# Altium project PuttPilot-Master.PrjPcb (part 1 of 4)
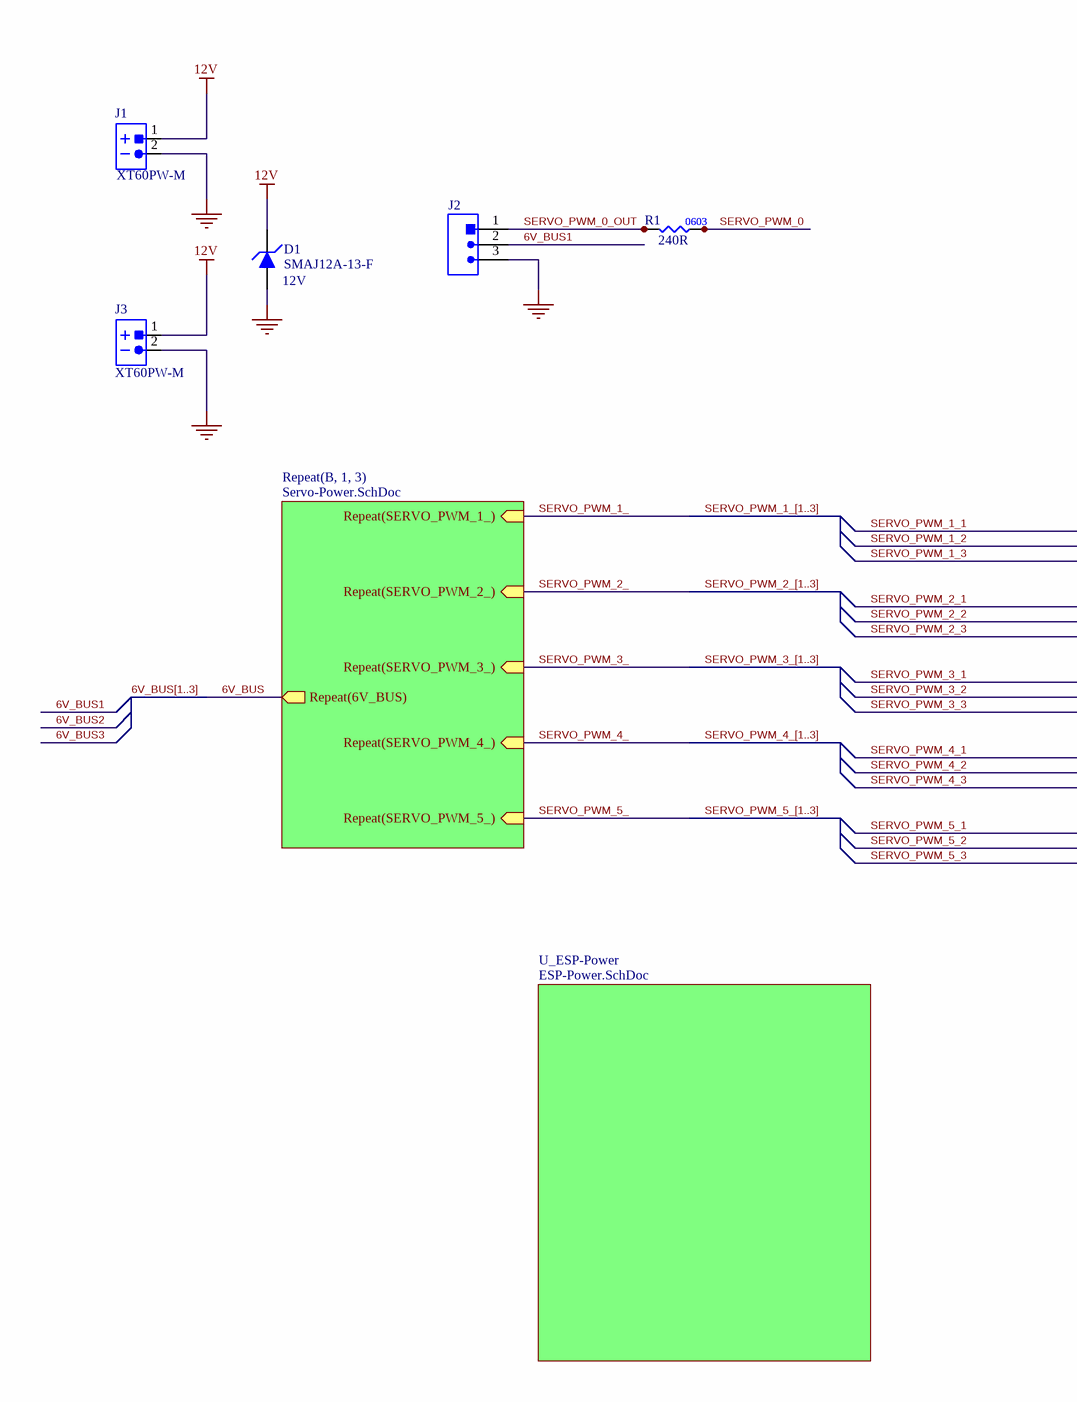
[diagram p0: Hierarchal.SchDoc, left]
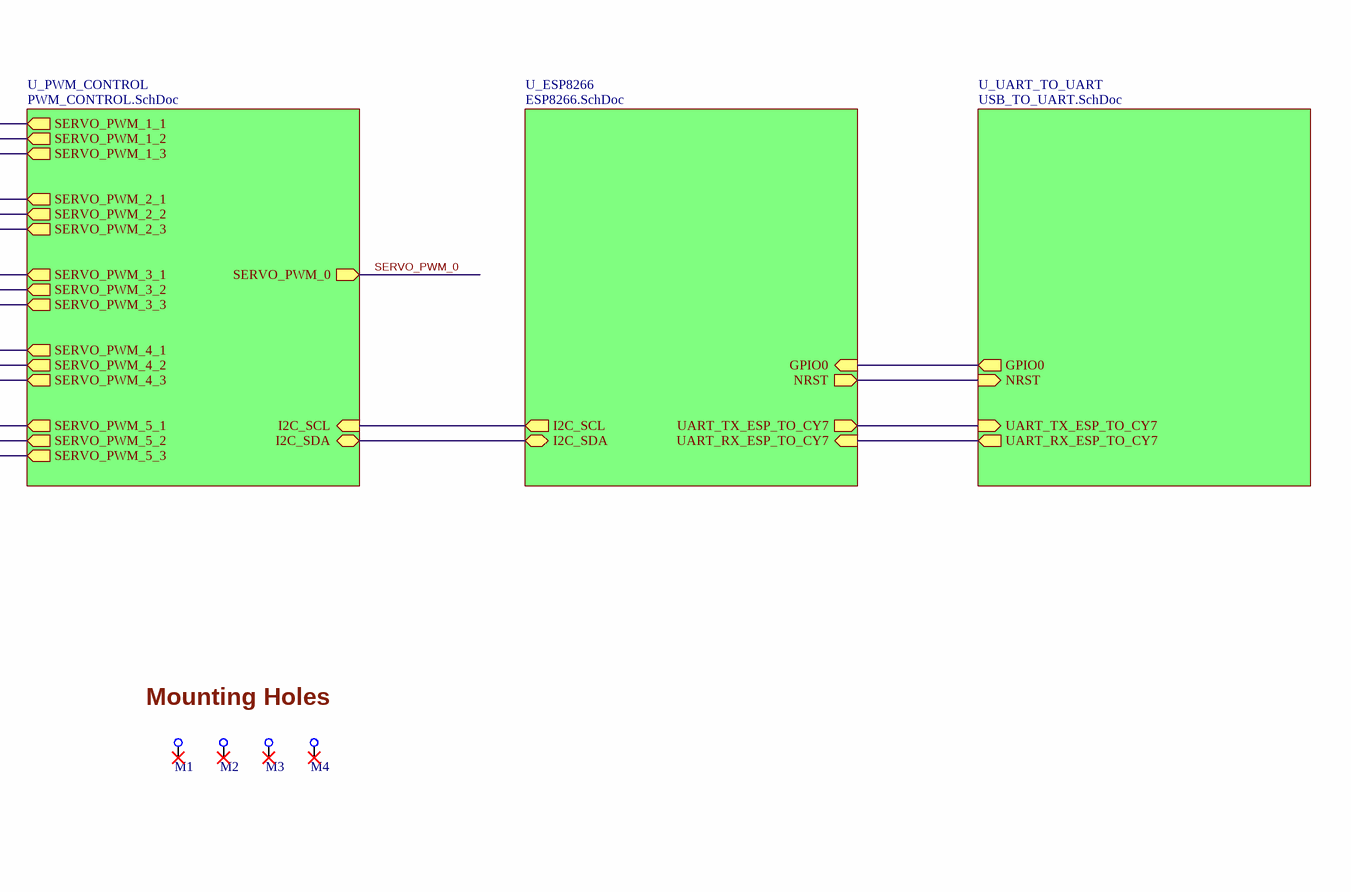
[diagram p1: Hierarchal.SchDoc, right]
6 sheets, 225 parts. Net scope: hierarchical (ports join the sheet entries above them; power ports are global).
Board file: PuttPilot-Master.PcbDoc
Sheets:
  Hierarchal.SchDoc
    U_PWM_CONTROL = PWM_CONTROL.SchDoc
    U_ESP8266 = ESP8266.SchDoc
    U_ESP-Power = ESP-Power.SchDoc
    U_UART_TO_UART = USB_TO_UART.SchDoc
    B1 = Servo-Power.SchDoc
    B2 = Servo-Power.SchDoc
    B3 = Servo-Power.SchDoc

## Sheet Hierarchal.SchDoc: Hierarchal Power
size 431 x 279 mm; DrawnBy: Ethan Abraham; Engineer: Ethan Abraham; SheetNumber: 2; SheetTotal: 7

### Parts
D1  SMAJ12A-13-F  Rep Pk Reverse Voltage-Max: 12V  [SMAJ12A-13-F]
J1  XT60PW-M  [XT60PW-M]
J2  PRPC040SAAN-RC  [HEADER_3POS_2.54MM]  (value not drawn)
J3  XT60PW-M  [XT60PW-M]
M1  .HOLE_M3  [.HOLE_M3]  (value not drawn)
M2  .HOLE_M3  [.HOLE_M3]  (value not drawn)
M3  .HOLE_M3  [.HOLE_M3]  (value not drawn)
M4  .HOLE_M3  [.HOLE_M3]  (value not drawn)
R1  Resistance: 240R  [.RES_0603]  (hidden comment: RC0603FR-07240RL)

### Sub-sheets
Repeat(B, 1, 3) = Servo-Power.SchDoc: Repeat(6V_BUS) (out), Repeat(SERVO_PWM_1_) (in), Repeat(SERVO_PWM_2_) (in), Repeat(SERVO_PWM_3_) (in), Repeat(SERVO_PWM_4_) (in), Repeat(SERVO_PWM_5_) (in)
U_ESP8266 = ESP8266.SchDoc: I2C_SDA (bidir), I2C_SCL (out), UART_TX_ESP_TO_CY7 (out), UART_RX_ESP_TO_CY7 (in), GPIO0 (in), NRST (out)
U_ESP-Power = ESP-Power.SchDoc: no entries
U_PWM_CONTROL = PWM_CONTROL.SchDoc: SERVO_PWM_0 (out), I2C_SCL (in), I2C_SDA (bidir), SERVO_PWM_1_1 (out), SERVO_PWM_2_1 (out), SERVO_PWM_3_1 (out), SERVO_PWM_4_1 (out), SERVO_PWM_5_1 (out), SERVO_PWM_1_2 (out), SERVO_PWM_2_2 (out), SERVO_PWM_3_2 (out), SERVO_PWM_4_2 (out), SERVO_PWM_5_2 (out), SERVO_PWM_1_3 (out), SERVO_PWM_2_3 (out), SERVO_PWM_3_3 (out), SERVO_PWM_4_3 (out), SERVO_PWM_5_3 (out)
U_UART_TO_UART = USB_TO_UART.SchDoc: UART_RX_ESP_TO_CY7 (out), UART_TX_ESP_TO_CY7 (in), NRST (in), GPIO0 (out)

### Nets
12V: D1.2(Pin_2) J1.1 J3.1
GND: D1.1(Pin_1) J1.2 J2.3 J3.2
6V_BUS: sheet Repeat(B, 1, 3)/Repeat(6V_BUS)
6V_BUS1: J2.2  [project net 6V_BUS]
GPIO0: sheet U_ESP8266/GPIO0, sheet U_UART_TO_UART/GPIO0
I2C_SCL: sheet U_PWM_CONTROL/I2C_SCL, sheet U_ESP8266/I2C_SCL
I2C_SDA: sheet U_PWM_CONTROL/I2C_SDA, sheet U_ESP8266/I2C_SDA
NRST: sheet U_ESP8266/NRST, sheet U_UART_TO_UART/NRST
SERVO_PWM_0: R1.2 ; sheet U_PWM_CONTROL/SERVO_PWM_0
SERVO_PWM_0_OUT: J2.1 R1.1
SERVO_PWM_1_: sheet Repeat(B, 1, 3)/Repeat(SERVO_PWM_1_)
SERVO_PWM_2_: sheet Repeat(B, 1, 3)/Repeat(SERVO_PWM_2_)
SERVO_PWM_3_: sheet Repeat(B, 1, 3)/Repeat(SERVO_PWM_3_)
SERVO_PWM_4_: sheet Repeat(B, 1, 3)/Repeat(SERVO_PWM_4_)
SERVO_PWM_5_: sheet Repeat(B, 1, 3)/Repeat(SERVO_PWM_5_)
UART_RX_ESP_TO_CY7: sheet U_ESP8266/UART_RX_ESP_TO_CY7, sheet U_UART_TO_UART/UART_RX_ESP_TO_CY7
UART_TX_ESP_TO_CY7: sheet U_ESP8266/UART_TX_ESP_TO_CY7, sheet U_UART_TO_UART/UART_TX_ESP_TO_CY7

Not connected (* = marked no-connect by the designer): M1 1*; M2 1*; M3 1*; M4 1*

### Buses and harness runs
bus 6V_BUS[1..3]
bus SERVO_PWM_1_[1..3]
bus SERVO_PWM_2_[1..3]
bus SERVO_PWM_3_[1..3]
bus SERVO_PWM_4_[1..3]
bus SERVO_PWM_5_[1..3]

### Notes on the sheet
- Mounting Holes
- PuttPilot
- 200 University Ave W
- Waterloo, Ontario, Canada
- PROJECT
- N2L 3G1
- REVISION
- DOCUMENT
- ENGINEER
- REVIEWER
- MODIFIED
- SHEET
- OF

### Library data of the parts
D1 = SMAJ12A-13-F: TVS DIODE 12VWM; Manufacturer: Diodes; Package Body Material: Plastic; Diode Element Material: SILICON; Diode Type: TRANS VOLTAGE SUPPRESSOR; Number of Elements: 1; Time @ Peak Reflow Temperature-Max (s): 40s; Polarity: Unidirectional; Additional Feature: EXCELLENT CLAMPING CAPABILITY; Max Breakdown Voltage: 14.7V; Min Breakdown Voltage: 13.3V; Breakdown Voltage-Nom: 14V; Clamping Voltage-Max: 19.9V; Non-rep Peak Rev Power Dis-Max: 400W; Max Power Dissipation: 1W; Qualification Status: Not Qualified; Supplier 1: Digikey; Manufacturer Part Number: SMAJ12A-13-F; RoHS: Yes; Category: TVS Diodes; Stock 1: 25706; Pricing 1: 1=0.29, 10=0.197, 100=0.1322, 500=0.1019, 1000=0.09178, 2000=0.08313 (USD); Number of Pins: 2; Package Shape: Rectangular; Terminal Finish: Tin; Min Operating Temperature: -55°C; Max Operating Temperature: 150°C; JESD-609 Code: e3; JESD-30 Code: R-PDSO-C2; Package Style: SMALL OUTLINEMeter; Surface Mount: Yes; Terminal Form: C BEND; Terminal Position: DUAL; Moisture Sensitivity Level: 1; Peak Reflow Temperature (Cel): 260°C; Technology: AVALANCHE; RoHS Compliant: Yes; Reach SVHC Compliant: No; ComponentLink1URL: https://datasheet.ciiva.com:443/pdfs/VipMasterIC/IC/DIOD/DIOD-S-A0009689838/DIOD-S-A0009691421-1.pdf?src-supplier=IHS+Markit; ComponentLink1Description: https://datasheet.ciiva.com:443/pdfs/VipMasterIC/IC/DIOD/DIOD-S-A0009689838/DIOD-S-A0009691421-1.pdf?src-supplier=IHS+Markit; ComponentLink2URL: https://datasheet.ciiva.com/15143/getdatasheetpartid-164236-15143864.pdf?src-supplier=Verical; ComponentLink2Description: https://datasheet.ciiva.com/15143/getdatasheetpartid-164236-15143864.pdf?src-supplier=Verical; Supplier Part Number 1: SMAJ12A-FDICT-ND
J1 J3 = XT60PW-M: XT60PW Male; Manufacturer: Unclassified; Manufacturer Part Number: XT60PW-M; Supplier Part Number 1: 1805375
J2 = PRPC040SAAN-RC: CONN HEADER VERT 3POS 2.54MM; Manufacturer: Sullins; Manufacturer Series: PRP; Connector Type: BOARD CONNECTOR; Contact Pattern: RECTANGULAR; Contact Style: SQ PIN-SKT; Number Of Connectors: 1; Rated Current (Signal): 3A; Number of Contacts: 40; Body Breadth: 0.1inch; Body Length: 4inch; Reference Standard: UL; Reliability: COMMERCIAL; Supplier 1: Digikey; Manufacturer Part Number: PRPC040SAAN-RC; RoHS: Yes; Category: Headers and Wire Housings; Stock 1: 73516; Pricing 1: 1=0.42, 10=0.316, 100=0.2417, 500=0.2017, 1000=0.18701, 5000=0.15795, 10000=0.14845 (USD); Mount: Board; Contact Material: Brass; Contact Finish - Mating: AU ON NI; Contact Finish - Termination: Gold (Au) - with Nickel (Ni) barrier; Insulation Material: Polybutylene; Min Operating Temperature: -40°C; Max Operating Temperature: 105°C; JESD-609 Code: e4; Contact Gender: Male; Mounting Style: STRAIGHT; Number Of PCB Rows: 1; Number of Rows Loaded: 1; PCB Contact Pattern: RECTANGULAR; Termination: Solder; Body Depth: 0.1inch; Mating Contact Pitch: 0.1inch; Terminal Length: 0.12inch; Terminal Pitch: 2.54mm; Reach SVHC Compliant: Yes; RoHS Compliant: Yes; ComponentLink1URL: https://datasheet.ciiva.com:443/pdfs/VipMasterIC/IC/SUCS/SUCSS00322/SUCSS00322-1.pdf?src-supplier=IHS+Markit; ComponentLink1Description: https://datasheet.ciiva.com:443/pdfs/VipMasterIC/IC/SUCS/SUCSS00322/SUCSS00322-1.pdf?src-supplier=IHS+Markit; ComponentLink2URL: https://datasheet.ciiva.com/16477/prpc040saan-rc-16477647.pdf?src-supplier=Future+Electronics; ComponentLink2Description: https://datasheet.ciiva.com/16477/prpc040saan-rc-16477647.pdf?src-supplier=Future+Electronics; ComponentLink3URL: https://datasheet.ciiva.com/741/xrxczzzsxxn-rc-st-11635-b-741205.pdf?src-supplier=Digikey; ComponentLink3Description: https://datasheet.ciiva.com/741/xrxczzzsxxn-rc-st-11635-b-741205.pdf?src-supplier=Digikey; Supplier Part Number 1: S1011EC-02-ND
M1-M4 = .HOLE_M3: .HOLE M3
R1 = RC0603FR-07240RL: RES 240 OHM 0603; Manufacturer: Yageo; Tolerance: 1%; Additional Feature: LASER TRIMMABLE; Rated Power Dissipation (P): 100mW; Rated Temperature: 70°C; Temperature Coefficient: 100ppm/°C; Working Voltage: 75V; Package Height: 0.45mm; Package Length: 1.6mm; Package Width: 0.8mm; Supplier 1: Future Electronics; Manufacturer Part Number: RC0603FR-07240RL; RoHS: Yes; Category: Chip SMD Resistors; Stock 1: 1760000; Pricing 1: 5000=0.0026, 50000=0.0025, 150000=0.0024, 375000=0.0023, 1000000=0.0022 (USD); Mount: Surface Mount; Number of Pins: 2; Package Shape: Rectangular; Size Code: 0603; Terminal Finish: Nickel; Min Operating Temperature: -55°C; Max Operating Temperature: 155°C; JESD-609 Code: e3; Resistor Type: FIXED RESISTOR; Construction: Chip; Package Style: SMTMeter; Packaging: Tape and Reel; Technology: METAL GLAZE/THICK FILM; Termination: Wraparound; Reach SVHC Compliant: Yes; RoHS Compliant: Yes; ComponentLink1URL: https://datasheet.ciiva.com:443/pdfs/VipMasterIC/IC/YAGO/YAGO-S-A0008145938/YAGO-S-A0008145938-1.pdf?src-supplier=IHS+Markit; ComponentLink1Description: https://datasheet.ciiva.com:443/pdfs/VipMasterIC/IC/YAGO/YAGO-S-A0008145938/YAGO-S-A0008145938-1.pdf?src-supplier=IHS+Markit; ComponentLink2URL: https://datasheet.ciiva.com/2508/pyu-r-int-thick-7-2508497.pdf?src-supplier=Digikey; ComponentLink2Description: https://datasheet.ciiva.com/2508/pyu-r-int-thick-7-2508497.pdf?src-supplier=Digikey; ComponentLink3URL: https://datasheet.ciiva.com/2508/pyu-r-int-thick-7-2508498.pdf?src-supplier=Digikey; ComponentLink3Description: https://datasheet.ciiva.com/2508/pyu-r-int-thick-7-2508498.pdf?src-supplier=Digikey; ComponentLink4URL: https://datasheet.ciiva.com/2508/pyu-r-int-thick-7-2508499.pdf?src-supplier=Digikey; ComponentLink4Description: https://datasheet.ciiva.com/2508/pyu-r-int-thick-7-2508499.pdf?src-supplier=Digikey; Supplier Part Number 1: 5308184

## Sheet PWM_CONTROL.SchDoc: PWM Control
size 279 x 215 mm; DrawnBy: Ethan Abraham; Engineer: Ethan Abraham; Revision: 1.0; SheetNumber: 7; SheetTotal: 7
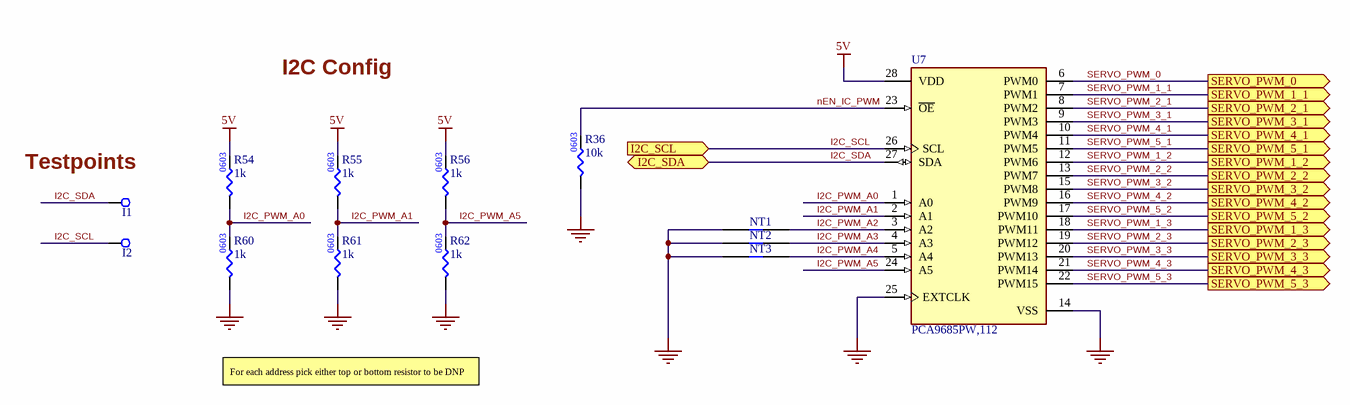
[diagram p2: PWM_CONTROL.SchDoc]

### Parts
I1  RCWCTE  [RCWCTE]  (value not drawn)
I2  RCWCTE  [RCWCTE]  (value not drawn)
NT1  .NET_TIE  [.NET_TIE]  (value not drawn)
NT2  .NET_TIE  [.NET_TIE]  (value not drawn)
NT3  .NET_TIE  [.NET_TIE]  (value not drawn)
R36  Resistance: 10k  [.RES_0603]  (hidden comment: RC0603FR-0710KL)
R54  Resistance: 1k  [.RES_0603]  (hidden comment: RC0603FR-071KL)
R55  Resistance: 1k  [.RES_0603]  (hidden comment: RC0603FR-071KL)
R56  Resistance: 1k  [.RES_0603]  (hidden comment: RC0603FR-071KL)
R60  Resistance: 1k  [.RES_0603]  (hidden comment: RC0603FR-071KL)
R61  Resistance: 1k  [.RES_0603]  (hidden comment: RC0603FR-071KL)
R62  Resistance: 1k  [.RES_0603]  (hidden comment: RC0603FR-071KL)
U7  PCA9685PW,112  [PCA9685PW,112]

### Ports
I2C_SCL (in), I2C_SDA (bidir), SERVO_PWM_0 (out), SERVO_PWM_1_1 (out), SERVO_PWM_1_2 (out), SERVO_PWM_1_3 (out), SERVO_PWM_2_1 (out), SERVO_PWM_2_2 (out), SERVO_PWM_2_3 (out), SERVO_PWM_3_1 (out), SERVO_PWM_3_2 (out), SERVO_PWM_3_3 (out), SERVO_PWM_4_1 (out), SERVO_PWM_4_2 (out), SERVO_PWM_4_3 (out), SERVO_PWM_5_1 (out), SERVO_PWM_5_2 (out), SERVO_PWM_5_3 (out)

### Nets
5V: R54.2 R55.2 R56.2 U7.28(VDD)
GND: NT1.1 NT2.1 NT3.1 R36.1 R60.1 R61.1 R62.1 U7.14(VSS) U7.25(EXTCLK)
I2C_PWM_A0: R54.1 R60.2 U7.1(A0)
I2C_PWM_A1: R55.1 R61.2 U7.2(A1)
I2C_PWM_A2: NT1.2 U7.3(A2)
I2C_PWM_A3: NT2.2 U7.4(A3)
I2C_PWM_A4: NT3.2 U7.5(A4)
I2C_PWM_A5: R56.1 R62.2 U7.24(A5)
I2C_SCL: I2.1 U7.26(SCL) ; port I2C_SCL
I2C_SDA: I1.1 U7.27(SDA) ; port I2C_SDA
nEN_IC_PWM: R36.2 U7.23(~{OE})
SERVO_PWM_0: U7.6(PWM0) ; port SERVO_PWM_0
SERVO_PWM_1_1: U7.7(PWM1) ; port SERVO_PWM_1_1  [project net SERVO_PWM_1_]
SERVO_PWM_1_2: U7.12(PWM6) ; port SERVO_PWM_1_2  [project net SERVO_PWM_1_]
SERVO_PWM_1_3: U7.18(PWM11) ; port SERVO_PWM_1_3  [project net SERVO_PWM_1_]
SERVO_PWM_2_1: U7.8(PWM2) ; port SERVO_PWM_2_1  [project net SERVO_PWM_2_]
SERVO_PWM_2_2: U7.13(PWM7) ; port SERVO_PWM_2_2  [project net SERVO_PWM_2_]
SERVO_PWM_2_3: U7.19(PWM12) ; port SERVO_PWM_2_3  [project net SERVO_PWM_2_]
SERVO_PWM_3_1: U7.9(PWM3) ; port SERVO_PWM_3_1  [project net SERVO_PWM_3_]
SERVO_PWM_3_2: U7.15(PWM8) ; port SERVO_PWM_3_2  [project net SERVO_PWM_3_]
SERVO_PWM_3_3: U7.20(PWM13) ; port SERVO_PWM_3_3  [project net SERVO_PWM_3_]
SERVO_PWM_4_1: U7.10(PWM4) ; port SERVO_PWM_4_1  [project net SERVO_PWM_4_]
SERVO_PWM_4_2: U7.16(PWM9) ; port SERVO_PWM_4_2  [project net SERVO_PWM_4_]
SERVO_PWM_4_3: U7.21(PWM14) ; port SERVO_PWM_4_3  [project net SERVO_PWM_4_]
SERVO_PWM_5_1: U7.11(PWM5) ; port SERVO_PWM_5_1  [project net SERVO_PWM_5_]
SERVO_PWM_5_2: U7.17(PWM10) ; port SERVO_PWM_5_2  [project net SERVO_PWM_5_]
SERVO_PWM_5_3: U7.22(PWM15) ; port SERVO_PWM_5_3  [project net SERVO_PWM_5_]

### Notes on the sheet
- I2C Config
- (near I1) Testpoints
- For each address pick either top or bottom resistor to be DNP
- PuttPilot
- 200 University Ave W
- PROJECT
- Waterloo, Ontario, Canada
- N2L 3G1
- REVISION
- DOCUMENT
- ENGINEER
- REVIEWER
- MODIFIED
- SHEET
- OF

### Library data of the parts
I1 I2 = RCWCTE: SMT Test Point; Manufacturer: KOA Speer; Resistance: 0R; Current Rating: 2A; Number of Contacts: 1; Supplier 1: Digikey; Manufacturer Part Number: RCWCTE; RoHS: Yes; Category: Chip SMD Resistors; Stock 1: 56953; Pricing 1: 1=0.2, 10=0.15, 25=0.1344, 50=0.1238, 100=0.1141, 250=0.10268, 500=0.09488, 1000=0.08781 (USD); Mount: Surface Mount; Case/Package: 1206; Case Code (Imperial): 1206; Case Code (Metric): 3216; Contact Material: Copper,Tin; Min Operating Temperature: -55°C; Max Operating Temperature: 125°C; Packaging: Tape and Reel; Termination: SMD/SMT; Series: RC; Length: 3.2mm; Width: 1.6mm; Height: 2mm; Depth: 1.6mm; Military Standard: Not; RoHS Compliant: Yes; ComponentLink1URL: https://datasheet.ciiva.com/34302/1876186-34302940.pdf?src-supplier=Jameco; ComponentLink1Description: https://datasheet.ciiva.com/34302/1876186-34302940.pdf?src-supplier=Jameco; ComponentLink2URL: https://datasheet.ciiva.com/5556/rc-5556236.pdf?src-supplier=Mouser; ComponentLink2Description: https://datasheet.ciiva.com/5556/rc-5556236.pdf?src-supplier=Mouser; ComponentLink3URL: https://datasheet.ciiva.com/26821/getdatasheetpartid-110197-26821157.pdf?src-supplier=Verical; ComponentLink3Description: https://datasheet.ciiva.com/26821/getdatasheetpartid-110197-26821157.pdf?src-supplier=Verical; Supplier Part Number 1: 2019-RCWCTECT-ND
NT1-NT3 = .NET_TIE: .GENERIC NET TIE
R36 = RC0603FR-0710KL: RES 10K OHM 0603; Manufacturer: Yageo; Tolerance: 1%; Additional Feature: LASER TRIMMABLE; Rated Power Dissipation (P): 100mW; Rated Temperature: 70°C; Temperature Coefficient: 100ppm/°C; Working Voltage: 75V; Package Height: 0.45mm; Package Length: 1.6mm; Package Width: 0.8mm; Supplier 1: Future Electronics; Manufacturer Part Number: RC0603FR-0710KL; RoHS: Yes; Category: Chip SMD Resistors; Stock 1: 30355000; Pricing 1: 5000=0.0026, 50000=0.0025, 150000=0.0024, 375000=0.0023, 1000000=0.0022 (USD); Mount: Surface Mount; Number of Pins: 2; Package Shape: Rectangular; Size Code: 0603; Terminal Finish: Nickel; Min Operating Temperature: -55°C; Max Operating Temperature: 155°C; JESD-609 Code: e3; Resistor Type: FIXED RESISTOR; Construction: Chip; Package Style: SMTMeter; Packaging: Tape and Reel; Technology: METAL GLAZE/THICK FILM; Termination: Wraparound; Reach SVHC Compliant: Yes; RoHS Compliant: Yes; ComponentLink1URL: https://datasheet.ciiva.com:443/pdfs/VipMasterIC/IC/YAGO/YAGO-S-A0008145938/YAGO-S-A0008145938-1.pdf?src-supplier=IHS+Markit; ComponentLink1Description: https://datasheet.ciiva.com:443/pdfs/VipMasterIC/IC/YAGO/YAGO-S-A0008145938/YAGO-S-A0008145938-1.pdf?src-supplier=IHS+Markit; ComponentLink2URL: https://datasheet.ciiva.com/22747/443971-22747519.pdf?src-supplier=Element14; ComponentLink2Description: https://datasheet.ciiva.com/22747/443971-22747519.pdf?src-supplier=Element14; ComponentLink3URL: https://datasheet.ciiva.com/46440/1868787-46440891.pdf?src-supplier=Element14; ComponentLink3Description: https://datasheet.ciiva.com/46440/1868787-46440891.pdf?src-supplier=Element14; ComponentLink4URL: https://datasheet.ciiva.com/15189/getdatasheetpartid-409289-15189591.pdf?src-supplier=Verical; ComponentLink4Description: https://datasheet.ciiva.com/15189/getdatasheetpartid-409289-15189591.pdf?src-supplier=Verical; ComponentLink5URL: https://datasheet.ciiva.com/7660/38590-7660789.pdf?src-supplier=Element14; ComponentLink5Description: https://datasheet.ciiva.com/7660/38590-7660789.pdf?src-supplier=Element14; ComponentLink6URL: https://datasheet.ciiva.com/7746/1738695-7746239.pdf?src-supplier=Element14; ComponentLink6Description: https://datasheet.ciiva.com/7746/1738695-7746239.pdf?src-supplier=Element14; ComponentLink7URL: https://datasheet.ciiva.com/7983/443971-7983596.pdf?src-supplier=Element14; ComponentLink7Description: https://datasheet.ciiva.com/7983/443971-7983596.pdf?src-supplier=Element14; Supplier Part Number 1: 4023214
R54-R56 R60-R62 = RC0603FR-071KL: RES 1K OHM 0603; Manufacturer: Yageo; Tolerance: 1%; Additional Feature: LASER TRIMMABLE; Rated Power Dissipation (P): 100mW; Rated Temperature: 70°C; Temperature Coefficient: 100ppm/°C; Working Voltage: 75V; Package Height: 0.45mm; Package Length: 1.6mm; Package Width: 0.8mm; Supplier 1: Future Electronics; Manufacturer Part Number: RC0603FR-071KL; RoHS: Yes; Category: Chip SMD Resistors; Stock 1: 12810000; Pricing 1: 5000=0.0026, 50000=0.0025, 150000=0.0024, 375000=0.0023, 1000000=0.0022 (USD); Mount: Surface Mount; Number of Pins: 2; Package Shape: Rectangular; Size Code: 0603; Terminal Finish: Nickel; Min Operating Temperature: -55°C; Max Operating Temperature: 155°C; JESD-609 Code: e3; Resistor Type: FIXED RESISTOR; Construction: Chip; Package Style: SMTMeter; Packaging: Tape and Reel; Technology: METAL GLAZE/THICK FILM; Termination: Wraparound; Reach SVHC Compliant: Yes; RoHS Compliant: Yes; ComponentLink1URL: https://datasheet.ciiva.com:443/pdfs/VipMasterIC/IC/YAGO/YAGO-S-A0008145938/YAGO-S-A0008145938-1.pdf?src-supplier=IHS+Markit; ComponentLink1Description: https://datasheet.ciiva.com:443/pdfs/VipMasterIC/IC/YAGO/YAGO-S-A0008145938/YAGO-S-A0008145938-1.pdf?src-supplier=IHS+Markit; ComponentLink2URL: https://datasheet.ciiva.com/11808/0900766b80f96399-11808081.pdf?src-supplier=Rs; ComponentLink2Description: https://datasheet.ciiva.com/11808/0900766b80f96399-11808081.pdf?src-supplier=Rs; ComponentLink3URL: https://datasheet.ciiva.com/8896/pyu-rc0603-51-rohs-l-4-8896106.pdf?src-supplier=Avnet; ComponentLink3Description: https://datasheet.ciiva.com/8896/pyu-rc0603-51-rohs-l-4-8896106.pdf?src-supplier=Avnet; ComponentLink4URL: https://datasheet.ciiva.com/7660/1868787-7660790.pdf?src-supplier=Element14; ComponentLink4Description: https://datasheet.ciiva.com/7660/1868787-7660790.pdf?src-supplier=Element14; ComponentLink5URL: https://datasheet.ciiva.com/7746/1738695-7746279.pdf?src-supplier=Element14; ComponentLink5Description: https://datasheet.ciiva.com/7746/1738695-7746279.pdf?src-supplier=Element14; ComponentLink6URL: https://datasheet.ciiva.com/7746/1686128-7746280.pdf?src-supplier=Element14; ComponentLink6Description: https://datasheet.ciiva.com/7746/1686128-7746280.pdf?src-supplier=Element14; ComponentLink7URL: https://datasheet.ciiva.com/7746/1738695-7746281.pdf?src-supplier=Element14; ComponentLink7Description: https://datasheet.ciiva.com/7746/1738695-7746281.pdf?src-supplier=Element14; ComponentLink8URL: https://datasheet.ciiva.com/7983/443971-7983613.pdf?src-supplier=Element14; ComponentLink8Description: https://datasheet.ciiva.com/7983/443971-7983613.pdf?src-supplier=Element14; ComponentLink9URL: https://datasheet.ciiva.com/15189/getdatasheetpartid-404327-15189644.pdf?src-supplier=Verical; ComponentLink9Description: https://datasheet.ciiva.com/15189/getdatasheetpartid-404327-15189644.pdf?src-supplier=Verical; Supplier Part Number 1: 4016291
U7 = PCA9685PW,112: I2C LED Driver; Manufacturer: NXP Semiconductors; Package Body Material: Plastic; Data Input Mode: SERIAL; fmax-Min: 1MHz; Interface IC Type: LED DISPLAY DRIVER; Multiplexed Display Capability: No; Number of Functions: 1; Number of Segments: 16; Package Equivalence Code: TSSOP28,.25; Power Supplies: 2.5/5V; Max Supply Voltage: 5.5V; Min Supply Voltage: 2.3V; Supply Voltage-Nom: 3V; Time @ Peak Reflow Temperature-Max (s): 30s; Qualification Status: Not Qualified; Supplier 1: Newark; Manufacturer Part Number: PCA9685PW,112; RoHS: Yes; Category: LED Drivers; Stock 1: 13575; Pricing 1: 1=1.3, 10=1.3, 25=1.3, 50=1.3, 100=1.3, 250=1.29, 500=1.27 (USD); Package Code: TSSOP; Number of Pins: 28; Package Shape: Rectangular; Terminal Finish: Gold; Min Operating Temperature: -40°C; Max Operating Temperature: 85°C; JESD-609 Code: e4; JESD-30 Code: R-PDSO-G28; Moisture Sensitivity Level: 1; Package Style: SMALL OUTLINE, THIN PROFILE, SHRINK PITCHMeter; Peak Reflow Temperature (Cel): 260°C; Surface Mount: Yes; Terminal Form: Gull Wing; Terminal Position: DUAL; Length: 9.7mm; Width: 4.4mm; Height - Seated (Max): 1.1mm; Terminal Pitch: 0.65mm; Temperature Grade: INDUSTRIAL; Reach SVHC Compliant: Yes; RoHS Compliant: Yes; ComponentLink1URL: https://datasheet.ciiva.com:443/pdfs/VipMasterIC/IC/PHGL/PHGL-S-A0000775254/PHGL-S-A0000775254-1.pdf?src-supplier=IHS+Markit; ComponentLink1Description: https://datasheet.ciiva.com:443/pdfs/VipMasterIC/IC/PHGL/PHGL-S-A0000775254/PHGL-S-A0000775254-1.pdf?src-supplier=IHS+Markit; ComponentLink2URL: https://datasheet.ciiva.com/1945/pca9685-1945096.pdf?src-supplier=Digikey; ComponentLink2Description: https://datasheet.ciiva.com/1945/pca9685-1945096.pdf?src-supplier=Digikey; ComponentLink3URL: https://datasheet.ciiva.com/8125/pca9685-8125354.pdf?src-supplier=Avnet; ComponentLink3Description: https://datasheet.ciiva.com/8125/pca9685-8125354.pdf?src-supplier=Avnet; Supplier Part Number 1: 85AC2130

## Sheet ESP8266.SchDoc: ESP8266
size 431 x 279 mm; DrawnBy: Ethan Abraham, Christopher Chung; Engineer: Ethan Abraham, Christopher Chung; Revision: 1.0; SheetNumber: 5; SheetTotal: 7
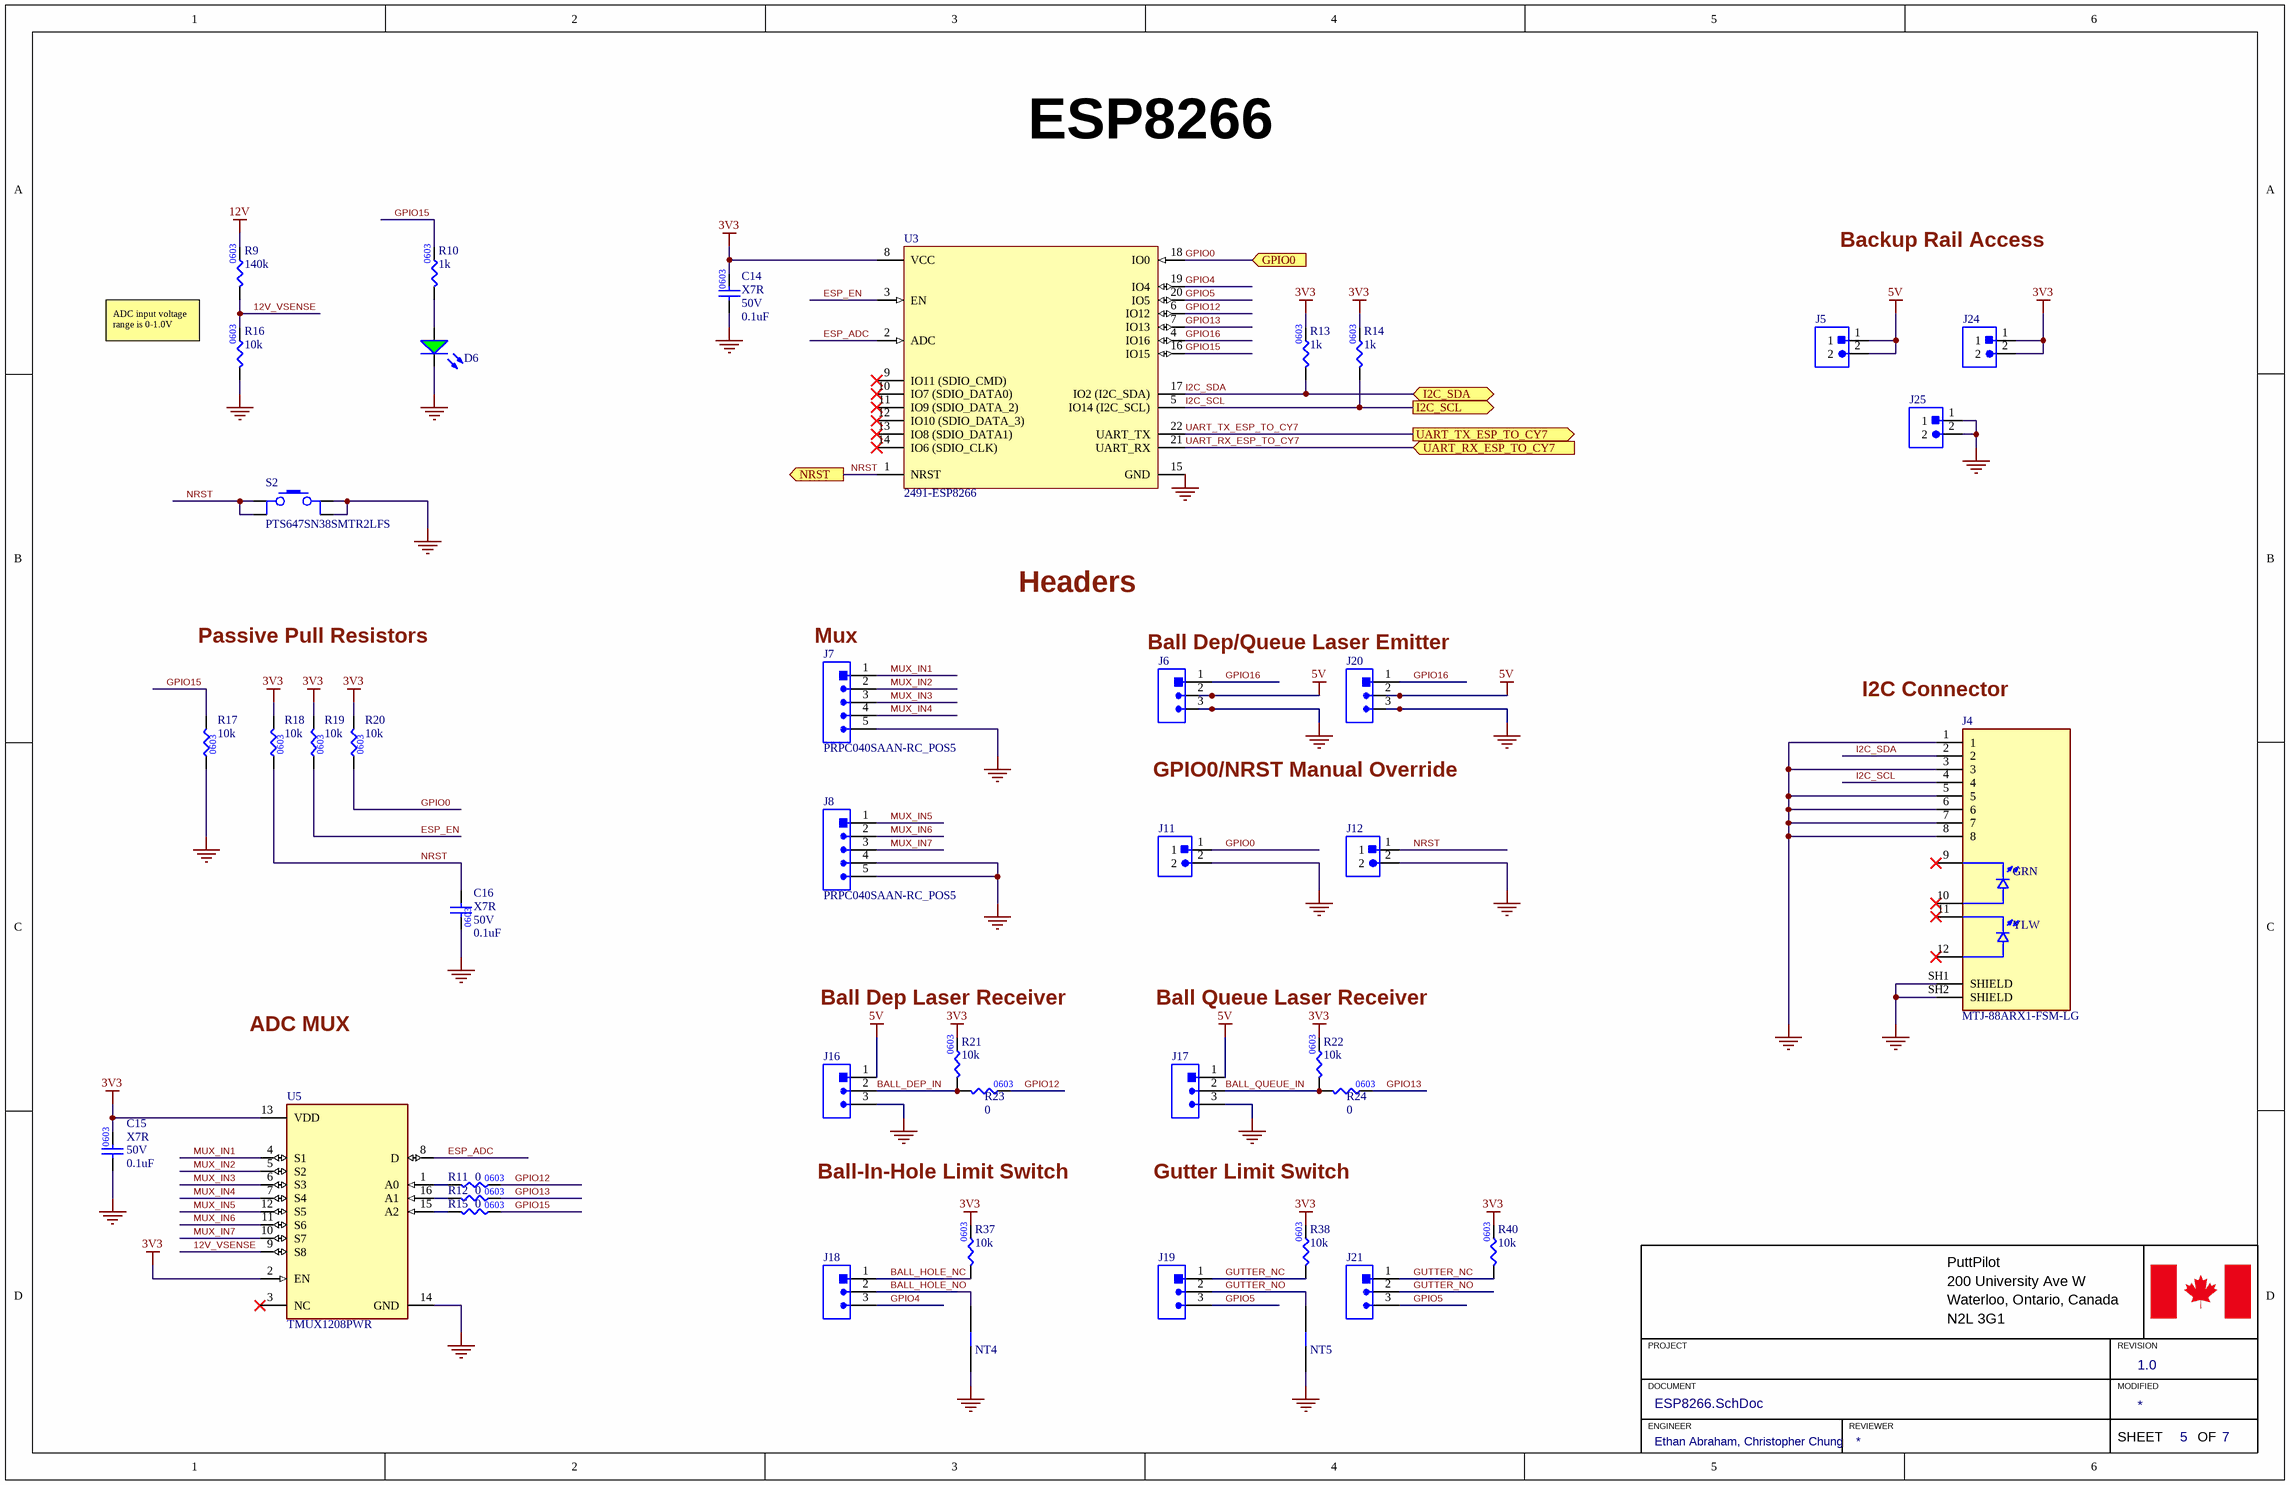
[diagram p3: ESP8266.SchDoc]

### Parts
C14  Temperature Characteristics Code: X7R  Rated DC Voltage (URdc): 50V  Capacitance: 0.1uF  [.CAP_0603]  (hidden comment: GCJ188R71H104KA12D)
C15  Temperature Characteristics Code: X7R  Rated DC Voltage (URdc): 50V  Capacitance: 0.1uF  [.CAP_0603]  (hidden comment: GCJ188R71H104KA12D)
C16  Temperature Characteristics Code: X7R  Rated DC Voltage (URdc): 50V  Capacitance: 0.1uF  [.CAP_0603]  (hidden comment: GCJ188R71H104KA12D)
D6  LTST-C191KGKT  [.LED_0603]  (value not drawn)
J4  MTJ-88ARX1-FSM-LG  [MTJ-88ARX1-FSM-LG]
J5  PRPC040SAAN-RC  [HEADER_2POS_2.54MM]  (value not drawn)
J6  PRPC040SAAN-RC  [HEADER_3POS_2.54MM]  (value not drawn)
J7  PRPC040SAAN-RC_POS5  [HEADER_5POS_2.54MM]
J8  PRPC040SAAN-RC_POS5  [HEADER_5POS_2.54MM]
J11  PRPC040SAAN-RC  [HEADER_2POS_2.54MM]  (value not drawn)
J12  PRPC040SAAN-RC  [HEADER_2POS_2.54MM]  (value not drawn)
J16  PRPC040SAAN-RC  [HEADER_3POS_2.54MM]  (value not drawn)
J17  PRPC040SAAN-RC  [HEADER_3POS_2.54MM]  (value not drawn)
J18  PRPC040SAAN-RC  [HEADER_3POS_2.54MM]  (value not drawn)
J19  PRPC040SAAN-RC  [HEADER_3POS_2.54MM]  (value not drawn)
J20  PRPC040SAAN-RC  [HEADER_3POS_2.54MM]  (value not drawn)
J21  PRPC040SAAN-RC  [HEADER_3POS_2.54MM]  (value not drawn)
J24  PRPC040SAAN-RC  [HEADER_2POS_2.54MM]  (value not drawn)
J25  PRPC040SAAN-RC  [HEADER_2POS_2.54MM]  (value not drawn)
NT4  .NET_TIE  [.NET_TIE]  (value not drawn)
NT5  .NET_TIE  [.NET_TIE]  (value not drawn)
R9  Resistance: 140k  [.RES_0603]  (hidden comment: RC0603FR-07140KL)
R10  Resistance: 1k  [.RES_0603]  (hidden comment: RC0603FR-071KL)
R11  Resistance: 0  [.RES_0603]  (hidden comment: RC0603JR-070RL)
R12  Resistance: 0  [.RES_0603]  (hidden comment: RC0603JR-070RL)
R13  Resistance: 1k  [.RES_0603]  (hidden comment: RC0603FR-071KL)
R14  Resistance: 1k  [.RES_0603]  (hidden comment: RC0603FR-071KL)
R15  Resistance: 0  [.RES_0603]  (hidden comment: RC0603JR-070RL)
R16  Resistance: 10k  [.RES_0603]  (hidden comment: RC0603FR-0710KL)
R17  Resistance: 10k  [.RES_0603]  (hidden comment: RC0603FR-0710KL)
R18  Resistance: 10k  [.RES_0603]  (hidden comment: RC0603FR-0710KL)
R19  Resistance: 10k  [.RES_0603]  (hidden comment: RC0603FR-0710KL)
R20  Resistance: 10k  [.RES_0603]  (hidden comment: RC0603FR-0710KL)
R21  Resistance: 10k  [.RES_0603]  (hidden comment: RC0603FR-0710KL)
R22  Resistance: 10k  [.RES_0603]  (hidden comment: RC0603FR-0710KL)
R23  Resistance: 0  [.RES_0603]  (hidden comment: RC0603JR-070RL)
R24  Resistance: 0  [.RES_0603]  (hidden comment: RC0603JR-070RL)
R37  Resistance: 10k  [.RES_0603]  (hidden comment: RC0603FR-0710KL)
R38  Resistance: 10k  [.RES_0603]  (hidden comment: RC0603FR-0710KL)
R40  Resistance: 10k  [.RES_0603]  (hidden comment: RC0603FR-0710KL)
S2  PTS647SN38SMTR2LFS  [PTS647SN38SMTR2LFS]
U3  2491-ESP8266  [2491-ESP8266]
U5  TMUX1208PWR  [TMUX1208]

### Ports
GPIO0 (in), I2C_SCL (out), I2C_SDA (bidir), NRST (out), UART_RX_ESP_TO_CY7 (in), UART_TX_ESP_TO_CY7 (out)

### Nets
3V3: C14.2 C15.2 J24.1 J24.2 R13.2 R14.2 R18.2 R19.2 R20.2 R21.2 R22.2 R37.2 R38.2 R40.2 U3.8(VCC) U5.2(EN) U5.13(VDD)
5V: J5.1 J5.2 J6.2 J16.1 J17.1 J20.2
12V: R9.2
GND: C14.1 C15.1 C16.1 D6.2(K) J4.1 J4.3 J4.5 J4.6 J4.7 J4.8 J4.SH1(SHIELD) J4.SH2(SHIELD) J6.3 J7.5 J8.4 J8.5 J11.2 J12.2 J16.3 J17.3 J20.3 J25.1 J25.2 NT4.1 NT5.1 R16.1 R17.1 S2.3 S2.4 U3.15(GND) U5.14(GND)
12V_VSENSE: R9.1 R16.2 U5.9(S8)
BALL_DEP_IN: J16.2 R21.1 R23.1
BALL_HOLE_NC: J18.1 R37.1
BALL_HOLE_NO: J18.2 NT4.2
BALL_QUEUE_IN: J17.2 R22.1 R24.1
ESP_ADC: U3.2(ADC) U5.8(D)
ESP_EN: R19.1 U3.3(EN)
GPIO0: J11.1 R20.1 U3.18(IO0) ; port GPIO0
GPIO4: J18.3 U3.19(IO4)
GPIO5: J19.3 J21.3 U3.20(IO5)
GPIO12: R11.2 R23.2 U3.6(IO12)
GPIO13: R12.2 R24.2 U3.7(IO13)
GPIO15: R10.2 R15.2 R17.2 U3.16(IO15)
GPIO16: J6.1 J20.1 U3.4(IO16)
GUTTER_NC: J19.1 J21.1 R38.1 R40.1
GUTTER_NO: J19.2 J21.2 NT5.2
I2C_SCL: J4.4 R14.1 U3.5(IO14_(I2C_SCL)) ; port I2C_SCL
I2C_SDA: J4.2 R13.1 U3.17(IO2_(I2C_SDA)) ; port I2C_SDA
MUX_IN1: J7.1 U5.4(S1)
MUX_IN2: J7.2 U5.5(S2)
MUX_IN3: J7.3 U5.6(S3)
MUX_IN4: J7.4 U5.7(S4)
MUX_IN5: J8.1 U5.12(S5)
MUX_IN6: J8.2 U5.11(S6)
MUX_IN7: J8.3 U5.10(S7)
NRST: C16.2 J12.1 R18.1 S2.1 S2.2 U3.1(NRST) ; port NRST
UART_RX_ESP_TO_CY7: U3.21(UART_RX) ; port UART_RX_ESP_TO_CY7
UART_TX_ESP_TO_CY7: U3.22(UART_TX) ; port UART_TX_ESP_TO_CY7
NetD6_1: D6.1(A) R10.1
NetR11_1: R11.1 U5.1(A0)
NetR12_1: R12.1 U5.16(A1)
NetR15_1: R15.1 U5.15(A2)

Not connected (* = marked no-connect by the designer): J4 9* 10* 11* 12*; U3 9(IO11_(SDIO_CMD))* 10(IO7_(SDIO_DATA0))* 11(IO9_(SDIO_DATA_2))* 12(IO10_(SDIO_DATA_3))* 13(IO8_(SDIO_DATA1))* 14(IO6_(SDIO_CLK))*; U5 3(NC)*

### Notes on the sheet
- Backup Rail Access
- ADC input voltage range is 0-1.0V
- Passive Pull Resistors
- (near J7) Mux
- Headers
- Ball Dep/Queue Laser Emitter
- (near J4) I2C Connector
- GPIO0/NRST Manual Override
- ADC MUX
- (near R21) Ball Dep Laser Receiver
- (near R22) Ball Queue Laser Receiver
- Ball-In-Hole Limit Switch
- Gutter Limit Switch
- PuttPilot
- 200 University Ave W
- Waterloo, Ontario, Canada
- PROJECT
- N2L 3G1
- REVISION
- DOCUMENT
- ENGINEER
- REVIEWER
- MODIFIED
- SHEET
- OF
- (in symbol MTJ-88ARX1-FSM-LG) GRN; YLW

### Library data of the parts
C14-C16 = GCJ188R71H104KA12D: CAP CER 0.1uF 50V X7R 0603; Manufacturer: Murata; Dielectric Material: Ceramic; Multilayer: Yes; Negative Tolerance: 10%; Reference Standard: AEC-Q200; Supplier 1: Future Electronics; Manufacturer Part Number: GCJ188R71H104KA12D; RoHS: Yes; Category: Ceramic Capacitors; Stock 1: 3280000; Pricing 1: 4000=0.0182, 12000=0.0178, 20000=0.0176, 80000=0.017, 120000=0.0167 (USD); Mount: Surface Mount; Number of Pins: 2; Package Shape: Rectangular; Size Code: 0603; Terminal Finish: Nickel; Min Operating Temperature: -55°C; Max Operating Temperature: 125°C; JESD-609 Code: e3; Capacitor Type: Ceramic; Package Style: SMTMeter; Packaging: Tape and Reel; Positive Tolerance: 10%; Termination: Wraparound; Length: 1.6mm; Width: 0.8mm; Height: 0.8mm; Reach SVHC Compliant: Yes; RoHS Compliant: Yes; ComponentLink1URL: https://psearch.en.murata.com:443/capacitor/product/GCJ188R71H104KA12%23.pdf?src-supplier=IHS+Markit; ComponentLink1Description: https://psearch.en.murata.com:443/capacitor/product/GCJ188R71H104KA12%23.pdf?src-supplier=IHS+Markit; ComponentLink2URL: https://datasheet.ciiva.com/135/product-135604.pdf?src-supplier=Digikey; ComponentLink2Description: https://datasheet.ciiva.com/135/product-135604.pdf?src-supplier=Digikey; ComponentLink3URL: https://datasheet.ciiva.com/26889/getdatasheetpartid-369886-26889118.pdf?src-supplier=Verical; ComponentLink3Description: https://datasheet.ciiva.com/26889/getdatasheetpartid-369886-26889118.pdf?src-supplier=Verical; ComponentLink4URL: https://datasheet.ciiva.com/135/s0717e-135605.pdf?src-supplier=Digikey; ComponentLink4Description: https://datasheet.ciiva.com/135/s0717e-135605.pdf?src-supplier=Digikey; ComponentLink5URL: https://datasheet.ciiva.com/135/s0717e-135606.pdf?src-supplier=Digikey; ComponentLink5Description: https://datasheet.ciiva.com/135/s0717e-135606.pdf?src-supplier=Digikey; ComponentLink6URL: https://datasheet.ciiva.com/16440/c03e-16440425.pdf?src-supplier=Future+Electronics; ComponentLink6Description: https://datasheet.ciiva.com/16440/c03e-16440425.pdf?src-supplier=Future+Electronics; Supplier Part Number 1: 1158604
D6 = LTST-C191KGKT: LED GREEN 2V 0603; Manufacturer: Vishay Lite-On; Shape: Rectangular; Lens Style: WATER CLEAR; Forward Current-Max: 30mA; Luminous Intensity-Nom: 35mcd; Number of Functions: 1; Optoelectronic Device Type: SINGLE COLOR LED; Viewing Angle: 130°; Forward Voltage-Max: 2.4V; Reverse Voltage-Max: 5V; Overall Height: 0.55mm; Supplier 1: Digikey; Manufacturer Part Number: LTST-C191KGKT; RoHS: Yes; Stock 1: 171853; Pricing 1: 1=0.22, 10=0.121, 100=0.0721, 500=0.05324, 1000=0.04748, 2000=0.04278 (USD); Mount: Surface Mount; Number of Pins: 2; Color: Green; Color@wavelength: Green; Terminal Finish: Tin; Min Operating Temperature: -55°C; Max Operating Temperature: 85°C; Packaging: Tape and Reel; JESD-609 Code: e3; Size: 1.1mm; Terminal Pitch: 1.5mm; Reach SVHC Compliant: Yes; RoHS Compliant: Yes; ComponentLink1URL: https://datasheet.ciiva.com:443/pdfs/VipMasterIC/IC/LITE/LITE-S-A0003156116/LITE-S-A0003156116-1.pdf?src-supplier=IHS+Markit; ComponentLink1Description: https://datasheet.ciiva.com:443/pdfs/VipMasterIC/IC/LITE/LITE-S-A0003156116/LITE-S-A0003156116-1.pdf?src-supplier=IHS+Markit; ComponentLink2URL: https://datasheet.ciiva.com/2109/ltst-c191kgkt-2109973.pdf?src-supplier=Digikey; ComponentLink2Description: https://datasheet.ciiva.com/2109/ltst-c191kgkt-2109973.pdf?src-supplier=Digikey; Supplier Part Number 1: 160-1446-1-ND
J4 = MTJ-88ARX1-FSM-LG: RJ45 JACK R/A SHIELDED; Manufacturer: Adam Equipment; Supplier 1: Digikey; Manufacturer Part Number: MTJ-88ARX1-FSM-LG; RoHS: No; Category: Connectors; Stock 1: 4560; Pricing 1: 1=0.99, 10=0.756, 25=0.68, 60=0.61483, 120=0.56858, 240=0.52642, 480=0.48815, 960=0.4534, 2400=0.41238 (USD); ComponentLink1URL: http://www.adam-tech.com/downloader.php?p=MTJ-88ARX1-FSM-LX.pdf&src-supplier=Digikey; ComponentLink1Description: http://www.adam-tech.com/downloader.php?p=MTJ-88ARX1-FSM-LX.pdf&src-supplier=Digikey; Supplier Part Number 1: 2057-MTJ-88ARX1-FSM-LG-ND
J5 J11 J12 J24 J25 = PRPC040SAAN-RC_POS2: CONN HEADER VERT 2POS 2.54MM; Manufacturer: Sullins; Manufacturer Series: PRP; Connector Type: BOARD CONNECTOR; Contact Pattern: RECTANGULAR; Contact Style: SQ PIN-SKT; Number Of Connectors: 1; Rated Current (Signal): 3A; Number of Contacts: 40; Body Breadth: 0.1inch; Body Length: 4inch; Reference Standard: UL; Reliability: COMMERCIAL; Supplier 1: Digikey; Manufacturer Part Number: PRPC040SAAN-RC; RoHS: Yes; Category: Headers and Wire Housings; Stock 1: 73516; Pricing 1: 1=0.42, 10=0.316, 100=0.2417, 500=0.2017, 1000=0.18701, 5000=0.15795, 10000=0.14845 (USD); Mount: Board; Contact Material: Brass; Contact Finish - Mating: AU ON NI; Contact Finish - Termination: Gold (Au) - with Nickel (Ni) barrier; Insulation Material: Polybutylene; Min Operating Temperature: -40°C; Max Operating Temperature: 105°C; JESD-609 Code: e4; Contact Gender: Male; Mounting Style: STRAIGHT; Number Of PCB Rows: 1; Number of Rows Loaded: 1; PCB Contact Pattern: RECTANGULAR; Termination: Solder; Body Depth: 0.1inch; Mating Contact Pitch: 0.1inch; Terminal Length: 0.12inch; Terminal Pitch: 2.54mm; Reach SVHC Compliant: Yes; RoHS Compliant: Yes; ComponentLink1URL: https://datasheet.ciiva.com:443/pdfs/VipMasterIC/IC/SUCS/SUCSS00322/SUCSS00322-1.pdf?src-supplier=IHS+Markit; ComponentLink1Description: https://datasheet.ciiva.com:443/pdfs/VipMasterIC/IC/SUCS/SUCSS00322/SUCSS00322-1.pdf?src-supplier=IHS+Markit; ComponentLink2URL: https://datasheet.ciiva.com/16477/prpc040saan-rc-16477647.pdf?src-supplier=Future+Electronics; ComponentLink2Description: https://datasheet.ciiva.com/16477/prpc040saan-rc-16477647.pdf?src-supplier=Future+Electronics; ComponentLink3URL: https://datasheet.ciiva.com/741/xrxczzzsxxn-rc-st-11635-b-741205.pdf?src-supplier=Digikey; ComponentLink3Description: https://datasheet.ciiva.com/741/xrxczzzsxxn-rc-st-11635-b-741205.pdf?src-supplier=Digikey; Supplier Part Number 1: S1011EC-02-ND
J6 J16-J21 = PRPC040SAAN-RC: as J2 on sheet Hierarchal; Supplier 1: Digikey; Manufacturer Part Number: PRPC040SAAN-RC; RoHS: Yes; Category: Headers and Wire Housings; Stock 1: 73516; Pricing 1: 1=0.42, 10=0.316, 100=0.2417, 500=0.2017, 1000=0.18701, 5000=0.15795, 10000=0.14845 (USD); Mount: Board; Contact Material: Brass; Contact Finish - Mating: AU ON NI; Contact Finish - Termination: Gold (Au) - with Nickel (Ni) barrier; Insulation Material: Polybutylene; Min Operating Temperature: -40°C; Max Operating Temperature: 105°C; JESD-609 Code: e4; Contact Gender: Male; Mounting Style: STRAIGHT; Number Of PCB Rows: 1; Number of Rows Loaded: 1; PCB Contact Pattern: RECTANGULAR; Termination: Solder; Body Depth: 0.1inch; Mating Contact Pitch: 0.1inch; Terminal Length: 0.12inch; Terminal Pitch: 2.54mm; Reach SVHC Compliant: Yes; RoHS Compliant: Yes; ComponentLink1URL: https://datasheet.ciiva.com:443/pdfs/VipMasterIC/IC/SUCS/SUCSS00322/SUCSS00322-1.pdf?src-supplier=IHS+Markit; ComponentLink1Description: https://datasheet.ciiva.com:443/pdfs/VipMasterIC/IC/SUCS/SUCSS00322/SUCSS00322-1.pdf?src-supplier=IHS+Markit; ComponentLink2URL: https://datasheet.ciiva.com/16477/prpc040saan-rc-16477647.pdf?src-supplier=Future+Electronics; ComponentLink2Description: https://datasheet.ciiva.com/16477/prpc040saan-rc-16477647.pdf?src-supplier=Future+Electronics; ComponentLink3URL: https://datasheet.ciiva.com/741/xrxczzzsxxn-rc-st-11635-b-741205.pdf?src-supplier=Digikey; ComponentLink3Description: https://datasheet.ciiva.com/741/xrxczzzsxxn-rc-st-11635-b-741205.pdf?src-supplier=Digikey; Supplier Part Number 1: S1011EC-02-ND
J7 J8 = PRPC040SAAN-RC_POS5: CONN HEADER VERT 5POS 2.54MM
NT4 NT5 = .NET_TIE: .GENERIC NET TIE
R9 = RC0603FR-07140KL: RES 140K OHM 0603; Manufacturer: Yageo; Tolerance: 1%; Power Rating: 100mW; Voltage Rating: 50V; Temperature Coefficient: 100ppm/°C; Supplier 1: Digikey; Manufacturer Part Number: RC0603FR-07140KL; RoHS: Yes; Category: Chip SMD Resistors; Stock 1: 245928; Pricing 1: 1=0.1, 10=0.011, 50=0.0086, 500=0.00612, 1000=0.00408 (USD); Case/Package: 0603; Case Code (Imperial): 0603; Case Code (Metric): 1608; Size Code: 0603; Min Operating Temperature: -55°C; Max Operating Temperature: 155°C; Packaging: Tape and Reel; Termination: SMD/SMT; Number of Terminations: 2; Max Power Dissipation: 100mW; Voltage Rating (DC): 50V; Features: Moisture Resistant; Series: RC; Length: 1.6mm; Width: 0.8mm; Height: 0.45mm; Lead Free: Lead Free; RoHS Compliant: Yes; ComponentLink1URL: https://datasheet.ciiva.com/2453/pyu-r-int-thick-7-2453916.pdf?src-supplier=Digikey; ComponentLink1Description: https://datasheet.ciiva.com/2453/pyu-r-int-thick-7-2453916.pdf?src-supplier=Digikey; ComponentLink2URL: https://datasheet.ciiva.com/2453/pyu-r-int-thick-7-2453917.pdf?src-supplier=Digikey; ComponentLink2Description: https://datasheet.ciiva.com/2453/pyu-r-int-thick-7-2453917.pdf?src-supplier=Digikey; ComponentLink3URL: https://datasheet.ciiva.com/2453/pyu-r-int-thick-7-2453918.pdf?src-supplier=Digikey; ComponentLink3Description: https://datasheet.ciiva.com/2453/pyu-r-int-thick-7-2453918.pdf?src-supplier=Digikey; Supplier Part Number 1: 311-140KHRCT-ND
R10 R13 R14 = RC0603FR-071KL: as R54 on sheet PWM_CONTROL; Supplier 1: Future Electronics; Manufacturer Part Number: RC0603FR-071KL; RoHS: Yes; Category: Chip SMD Resistors; Stock 1: 12810000; Pricing 1: 5000=0.0026, 50000=0.0025, 150000=0.0024, 375000=0.0023, 1000000=0.0022 (USD); Mount: Surface Mount; Number of Pins: 2; Package Shape: Rectangular; Size Code: 0603; Terminal Finish: Nickel; Min Operating Temperature: -55°C; Max Operating Temperature: 155°C; JESD-609 Code: e3; Resistor Type: FIXED RESISTOR; Construction: Chip; Package Style: SMTMeter; Packaging: Tape and Reel; Technology: METAL GLAZE/THICK FILM; Termination: Wraparound; Reach SVHC Compliant: Yes; RoHS Compliant: Yes; ComponentLink1URL: https://datasheet.ciiva.com:443/pdfs/VipMasterIC/IC/YAGO/YAGO-S-A0008145938/YAGO-S-A0008145938-1.pdf?src-supplier=IHS+Markit; ComponentLink1Description: https://datasheet.ciiva.com:443/pdfs/VipMasterIC/IC/YAGO/YAGO-S-A0008145938/YAGO-S-A0008145938-1.pdf?src-supplier=IHS+Markit; ComponentLink2URL: https://datasheet.ciiva.com/11808/0900766b80f96399-11808081.pdf?src-supplier=Rs; ComponentLink2Description: https://datasheet.ciiva.com/11808/0900766b80f96399-11808081.pdf?src-supplier=Rs; ComponentLink3URL: https://datasheet.ciiva.com/8896/pyu-rc0603-51-rohs-l-4-8896106.pdf?src-supplier=Avnet; ComponentLink3Description: https://datasheet.ciiva.com/8896/pyu-rc0603-51-rohs-l-4-8896106.pdf?src-supplier=Avnet; ComponentLink4URL: https://datasheet.ciiva.com/7660/1868787-7660790.pdf?src-supplier=Element14; ComponentLink4Description: https://datasheet.ciiva.com/7660/1868787-7660790.pdf?src-supplier=Element14; ComponentLink5URL: https://datasheet.ciiva.com/7746/1738695-7746279.pdf?src-supplier=Element14; ComponentLink5Description: https://datasheet.ciiva.com/7746/1738695-7746279.pdf?src-supplier=Element14; ComponentLink6URL: https://datasheet.ciiva.com/7746/1686128-7746280.pdf?src-supplier=Element14; ComponentLink6Description: https://datasheet.ciiva.com/7746/1686128-7746280.pdf?src-supplier=Element14; ComponentLink7URL: https://datasheet.ciiva.com/7746/1738695-7746281.pdf?src-supplier=Element14; ComponentLink7Description: https://datasheet.ciiva.com/7746/1738695-7746281.pdf?src-supplier=Element14; ComponentLink8URL: https://datasheet.ciiva.com/7983/443971-7983613.pdf?src-supplier=Element14; ComponentLink8Description: https://datasheet.ciiva.com/7983/443971-7983613.pdf?src-supplier=Element14; ComponentLink9URL: https://datasheet.ciiva.com/15189/getdatasheetpartid-404327-15189644.pdf?src-supplier=Verical; ComponentLink9Description: https://datasheet.ciiva.com/15189/getdatasheetpartid-404327-15189644.pdf?src-supplier=Verical; Supplier Part Number 1: 4016291
R11 R12 R15 R23 R24 = RC0603JR-070RL: RES 0 OHM 0603; Manufacturer: Yageo; Manufacturer Part Number: RC0603FR-071KL; Tolerance: 1%; Additional Feature: LASER TRIMMABLE; Rated Power Dissipation (P): 100mW; Rated Temperature: 70°C; Temperature Coefficient: 100ppm/°C; Working Voltage: 75V; Package Height: 0.45mm; Package Length: 1.6mm; Package Width: 0.8mm; Supplier 1: Future Electronics; RoHS: Yes; Category: Chip SMD Resistors; Stock 1: 12810000; Pricing 1: 5000=0.0026, 50000=0.0025, 150000=0.0024, 375000=0.0023, 1000000=0.0022 (USD); Mount: Surface Mount; Number of Pins: 2; Package Shape: Rectangular; Size Code: 0603; Terminal Finish: Nickel; Min Operating Temperature: -55°C; Max Operating Temperature: 155°C; JESD-609 Code: e3; Resistor Type: FIXED RESISTOR; Construction: Chip; Package Style: SMTMeter; Packaging: Tape and Reel; Technology: METAL GLAZE/THICK FILM; Termination: Wraparound; Reach SVHC Compliant: Yes; RoHS Compliant: Yes; ComponentLink1URL: https://datasheet.ciiva.com:443/pdfs/VipMasterIC/IC/YAGO/YAGO-S-A0008145938/YAGO-S-A0008145938-1.pdf?src-supplier=IHS+Markit; ComponentLink1Description: https://datasheet.ciiva.com:443/pdfs/VipMasterIC/IC/YAGO/YAGO-S-A0008145938/YAGO-S-A0008145938-1.pdf?src-supplier=IHS+Markit; ComponentLink2URL: https://datasheet.ciiva.com/11808/0900766b80f96399-11808081.pdf?src-supplier=Rs; ComponentLink2Description: https://datasheet.ciiva.com/11808/0900766b80f96399-11808081.pdf?src-supplier=Rs; ComponentLink3URL: https://datasheet.ciiva.com/8896/pyu-rc0603-51-rohs-l-4-8896106.pdf?src-supplier=Avnet; ComponentLink3Description: https://datasheet.ciiva.com/8896/pyu-rc0603-51-rohs-l-4-8896106.pdf?src-supplier=Avnet; ComponentLink4URL: https://datasheet.ciiva.com/7660/1868787-7660790.pdf?src-supplier=Element14; ComponentLink4Description: https://datasheet.ciiva.com/7660/1868787-7660790.pdf?src-supplier=Element14; ComponentLink5URL: https://datasheet.ciiva.com/7746/1738695-7746279.pdf?src-supplier=Element14; ComponentLink5Description: https://datasheet.ciiva.com/7746/1738695-7746279.pdf?src-supplier=Element14; ComponentLink6URL: https://datasheet.ciiva.com/7746/1686128-7746280.pdf?src-supplier=Element14; ComponentLink6Description: https://datasheet.ciiva.com/7746/1686128-7746280.pdf?src-supplier=Element14; ComponentLink7URL: https://datasheet.ciiva.com/7746/1738695-7746281.pdf?src-supplier=Element14; ComponentLink7Description: https://datasheet.ciiva.com/7746/1738695-7746281.pdf?src-supplier=Element14; ComponentLink8URL: https://datasheet.ciiva.com/7983/443971-7983613.pdf?src-supplier=Element14; ComponentLink8Description: https://datasheet.ciiva.com/7983/443971-7983613.pdf?src-supplier=Element14; ComponentLink9URL: https://datasheet.ciiva.com/15189/getdatasheetpartid-404327-15189644.pdf?src-supplier=Verical; ComponentLink9Description: https://datasheet.ciiva.com/15189/getdatasheetpartid-404327-15189644.pdf?src-supplier=Verical; Supplier Part Number 1: 4016291
R16-R22 R37 R38 R40 = RC0603FR-0710KL: as R36 on sheet PWM_CONTROL; Supplier 1: Future Electronics; Manufacturer Part Number: RC0603FR-0710KL; RoHS: Yes; Category: Chip SMD Resistors; Stock 1: 30355000; Pricing 1: 5000=0.0026, 50000=0.0025, 150000=0.0024, 375000=0.0023, 1000000=0.0022 (USD); Mount: Surface Mount; Number of Pins: 2; Package Shape: Rectangular; Size Code: 0603; Terminal Finish: Nickel; Min Operating Temperature: -55°C; Max Operating Temperature: 155°C; JESD-609 Code: e3; Resistor Type: FIXED RESISTOR; Construction: Chip; Package Style: SMTMeter; Packaging: Tape and Reel; Technology: METAL GLAZE/THICK FILM; Termination: Wraparound; Reach SVHC Compliant: Yes; RoHS Compliant: Yes; ComponentLink1URL: https://datasheet.ciiva.com:443/pdfs/VipMasterIC/IC/YAGO/YAGO-S-A0008145938/YAGO-S-A0008145938-1.pdf?src-supplier=IHS+Markit; ComponentLink1Description: https://datasheet.ciiva.com:443/pdfs/VipMasterIC/IC/YAGO/YAGO-S-A0008145938/YAGO-S-A0008145938-1.pdf?src-supplier=IHS+Markit; ComponentLink2URL: https://datasheet.ciiva.com/22747/443971-22747519.pdf?src-supplier=Element14; ComponentLink2Description: https://datasheet.ciiva.com/22747/443971-22747519.pdf?src-supplier=Element14; ComponentLink3URL: https://datasheet.ciiva.com/46440/1868787-46440891.pdf?src-supplier=Element14; ComponentLink3Description: https://datasheet.ciiva.com/46440/1868787-46440891.pdf?src-supplier=Element14; ComponentLink4URL: https://datasheet.ciiva.com/15189/getdatasheetpartid-409289-15189591.pdf?src-supplier=Verical; ComponentLink4Description: https://datasheet.ciiva.com/15189/getdatasheetpartid-409289-15189591.pdf?src-supplier=Verical; ComponentLink5URL: https://datasheet.ciiva.com/7660/38590-7660789.pdf?src-supplier=Element14; ComponentLink5Description: https://datasheet.ciiva.com/7660/38590-7660789.pdf?src-supplier=Element14; ComponentLink6URL: https://datasheet.ciiva.com/7746/1738695-7746239.pdf?src-supplier=Element14; ComponentLink6Description: https://datasheet.ciiva.com/7746/1738695-7746239.pdf?src-supplier=Element14; ComponentLink7URL: https://datasheet.ciiva.com/7983/443971-7983596.pdf?src-supplier=Element14; ComponentLink7Description: https://datasheet.ciiva.com/7983/443971-7983596.pdf?src-supplier=Element14; Supplier Part Number 1: 4023214
S2 = PTS647SN38SMTR2LFS: SWITCH TACTILE SPST-NO 0.05A 12V; Manufacturer: ITT C&K; Supplier 1: Digikey; Manufacturer Part Number: PTS647SN38SMTR2LFS; RoHS: No; Stock 1: 23499; Pricing 1: 1=0.26, 10=0.249, 25=0.236, 100=0.2138, 250=0.19488, 500=0.18114, 1000=0.15453 (USD); RoHS Compliant: Yes; ComponentLink1URL: https://www.ckswitches.com/media/2567/pts647.pdf?src-supplier=Digikey; ComponentLink1Description: https://www.ckswitches.com/media/2567/pts647.pdf?src-supplier=Digikey; ComponentLink2URL: https://datasheet.octopart.com/PTS647SN38SMTR2LFS-C%26K-Components-datasheet-117317067.pdf?src-supplier=Future+Electronics; ComponentLink2Description: https://datasheet.octopart.com/PTS647SN38SMTR2LFS-C%26K-Components-datasheet-117317067.pdf?src-supplier=Future+Electronics; ComponentLink3URL: https://datasheet.octopart.com/PTS647SN38SMTR2LFS-C%26K-Components-datasheet-156105943.pdf?src-supplier=TME; ComponentLink3Description: https://datasheet.octopart.com/PTS647SN38SMTR2LFS-C%26K-Components-datasheet-156105943.pdf?src-supplier=TME; Supplier Part Number 1: PTS647SN38SMTR2LFSCT-ND
U3 = 2491-ESP8266: ESP8266 + Trace Antenna, 4MB Flash
U5 = TMUX1208PWR: Single-Ended Multiplexer, 1 Func, 8 Channel, CMOS, PDSO16; Manufacturer: Texas Instruments; Supplier 1: Mouser; Manufacturer Part Number: TMUX1208PWR; RoHS: Yes; Category: Decoders and Multiplexers; Stock 1: 17357; Pricing 1: 1=0.71, 10=0.437, 50=0.437, 100=0.348, 1000=0.311, 10000=0.287 (USD); Analog IC - Other Type: SINGLE-ENDED MULTIPLEXER; Reach SVHC Compliant: Yes; RoHS Compliant: Yes; ComponentLink1URL: https://www.ti.com:443/lit/ds/symlink/tmux1208.pdf?src-supplier=IHS+Markit; ComponentLink1Description: https://www.ti.com:443/lit/ds/symlink/tmux1208.pdf?src-supplier=IHS+Markit; ComponentLink2URL: http://www.ti.com/general/docs/suppproductinfo.tsp?distId=10&amp;gotoUrl=http%3A%2F%2Fwww.ti.com%2Flit%2Fgpn%2Ftmux1208&src-supplier=Digikey; ComponentLink2Description: http://www.ti.com/general/docs/suppproductinfo.tsp?distId=10&amp;gotoUrl=http%3A%2F%2Fwww.ti.com%2Flit%2Fgpn%2Ftmux1208&src-supplier=Digikey; Supplier Part Number 1: 595-TMUX1208PWR